# Altium schematic sheet servo-hbridge.SchDoc
size A
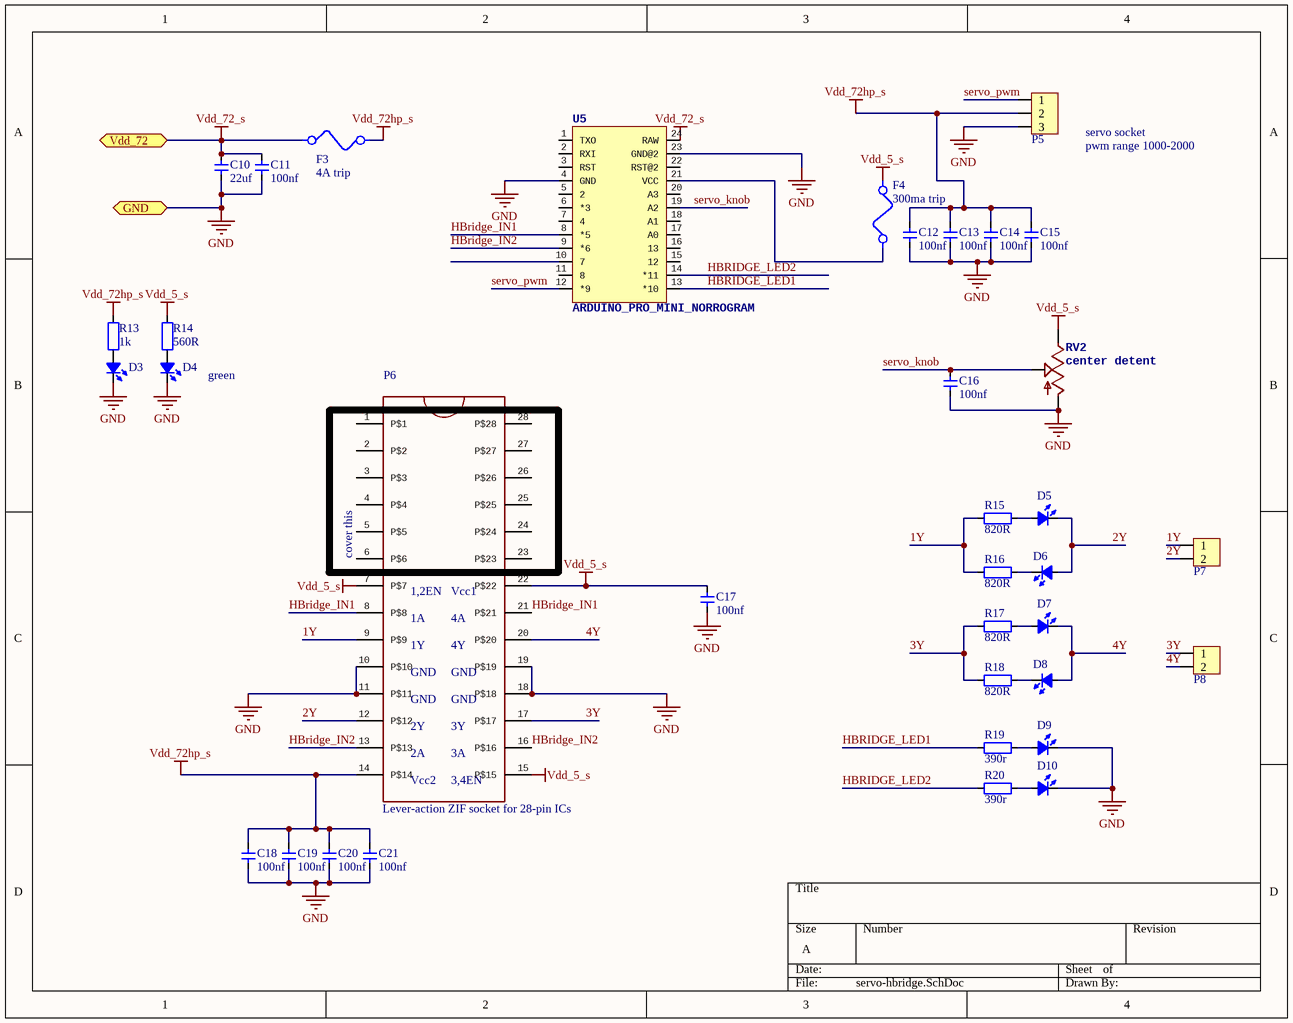
[diagram p0: servo-hbridge.SchDoc]

## Parts
C10  value 22uf  [CAP_0805]  (hidden comment: Cap_0805)
C11  value 100nf  [CAP_0805]  (hidden comment: Cap_0805)
C12  value 100nf  [CAP_0805]  (hidden comment: Cap_0805)
C13  value 100nf  [CAP_0805]  (hidden comment: Cap_0805)
C14  value 100nf  [CAP_0805]  (hidden comment: Cap_0805)
C15  value 100nf  [CAP_0805]  (hidden comment: Cap_0805)
C16  value 100nf  [CAP_0805]  (hidden comment: Cap_0805)
C17  value 100nf  [CAP_0805]  (hidden comment: Cap_0805)
C18  value 100nf  [CAP_0805]  (hidden comment: Cap_0805)
C19  value 100nf  [CAP_0805]  (hidden comment: Cap_0805)
C20  value 100nf  [CAP_0805]  (hidden comment: Cap_0805)
C21  value 100nf  [CAP_0805]  (hidden comment: Cap_0805)
D3  LED_0805  [LED_0805_RED]  (value not drawn)
D4  LED_0805  [LED_0805_RED]  (value not drawn)
D5  LED_0805  [LED_0805_YELLOW]  (value not drawn)
D6  LED_0805  [LED_0805_YELLOW]  (value not drawn)
D7  LED_0805  [LED_0805_YELLOW]  (value not drawn)
D8  LED_0805  [LED_0805_YELLOW]  (value not drawn)
D9  LED_0805  [LED_0805_YELLOW]  (value not drawn)
D10  LED_0805  [LED_0805_YELLOW]  (value not drawn)
F3  4A trip  [Multifuse1812]
F4  300ma trip  [Multifuse1812]
P5  HDR1x3_2.54  [HDR1X3_2.54_180]  (value not drawn)
P6  Lever-action ZIF socket for 28-pin ICs  [DIL28-3-ZIF_SOCKET]
P7  HDR1x2_2.54  [HDR1X2_2.54_180]  (value not drawn)
P8  HDR1x2_2.54  [HDR1X2_2.54_180]  (value not drawn)
R13  value 1k  [RES_0805]  (hidden comment: Res_0805)
R14  value 560R  [RES_0805]  (hidden comment: Res_0805)
R15  value 820R  [RES_0805]  (hidden comment: Res_0805)
R16  value 820R  [RES_0805]  (hidden comment: Res_0805)
R17  value 820R  [RES_0805]  (hidden comment: Res_0805)
R18  value 820R  [RES_0805]  (hidden comment: Res_0805)
R19  value 390r  [RES_0805]  (hidden comment: Res_0805)
R20  value 390r  [RES_0805]  (hidden comment: Res_0805)
RV2  center detent  [Bourns-slimline-axialbracket]
U5  ARDUINO_PRO_MINI_NORROGRAM  [ARDUINO_PRO_MINI_NOPROGRAM]

## Ports
GND, Vdd_72

## Nets
GND: C10.1 C11.1 C12.2 C13.2 C14.2 C15.2 C16.2 C17.1 C18.2 C19.2 C20.2 C21.2 D3.2(K) D4.2(K) D9.2(K) D10.2(K) P5.3 P6.10(P$10) P6.11(P$11) P6.18(P$18) P6.19(P$19) RV2.P$3(A) U5.4(GND) U5.23(GND@2) ; port GND
Vdd_5_s: C17.2 F4.2 P6.7(P$7) P6.15(P$15) P6.22(P$22) R14.2 RV2.P$1(E)
Vdd_72_s: C10.2 C11.2 F3.1 U5.24(RAW) ; port Vdd_72
Vdd_72hp_s: C12.1 C13.1 C14.1 C15.1 C18.1 C19.1 C20.1 C21.1 F3.2 P5.2 P6.14(P$14) R13.2
1Y: P6.9(P$9) P7.1 R15.1 R16.1
2Y: D5.2(K) D6.1(A) P6.12(P$12) P7.2
3Y: P6.17(P$17) P8.1 R17.1 R18.1
4Y: D7.2(K) D8.1(A) P6.20(P$20) P8.2
HBridge_IN1: P6.8(P$8) P6.21(P$21) U5.8(*5)
HBridge_IN2: P6.13(P$13) P6.16(P$16) U5.9(*6)
HBRIDGE_LED1: R19.1 U5.13(*10)
HBRIDGE_LED2: R20.1 U5.14(*11)
servo_knob: C16.1 RV2.P$2(S) U5.19(A2)
servo_pwm: P5.1 U5.12(*9)
NetD3_1: D3.1(A) R13.1
NetD4_1: D4.1(A) R14.1
NetD5_1: D5.1(A) R15.2
NetD6_2: D6.2(K) R16.2
NetD7_1: D7.1(A) R17.2
NetD8_2: D8.2(K) R18.2
NetD9_1: D9.1(A) R19.2
NetD10_1: D10.1(A) R20.2
NetF4_1: F4.1 U5.21(VCC)

Not connected (* = marked no-connect by the designer): P6 1(P$1) 2(P$2) 3(P$3) 4(P$4) 5(P$5) 6(P$6) 23(P$23) 24(P$24) 25(P$25) 26(P$26) 27(P$27) 28(P$28); U5 1(TXO) 2(RXI) 3(RST) 5(2) 6(*3) 7(4) 10(7) 11(8) 15(12) 16(13) 17(A0) 18(A1) 20(A3) 22(RST@2)

## Notes on the sheet
- servo socket
- pwm range 1000-2000
- green
- (near P6) cover this
- (near P6) 1A
- (near P6) 1,2EN
- (near P6) 4A
- (near P6) Vcc1
- (near P6) GND
- (near P6) 1Y
- (near P6) 4Y
- (near P6) 2A
- (near P6) 2Y
- (near P6) 3A
- (near P6) 3Y
- (near P6) Vcc2
- (near P6) 3,4EN

## Library data of the parts
C10-C21 = Cap_0805: Capacitor
D3-D10 = LED_0805: LED
F3 F4 = Multifuse: RO ZEK MULTI 500MA SMD 1812 MF-MSMF050-2 BOURNS; ID: Library_FUSE-0001; Faber ItemCode: 35502800; Info: MULTIFUSE, SMD, 0.5A; Value: 0.5A; Mfg: BOURNS; Mfg code: MF-MSMF050-2
P5 = HDR1x3_2.54: Header
P6 = ZIFSOCKET-28-3ZIFFSOCKET-28-3
P7 P8 = HDR1x2_2.54: Header
R13-R20 = Res_0805: Resistor
RV2 = POTALPS-KIT: pin to pad: P$1>1 P$2>2 P$3>3; PROD_ID: RES-09177